# EAGLE design Blocky_Node (EAGLE 9.2.1)

## Sheet 1 of 2
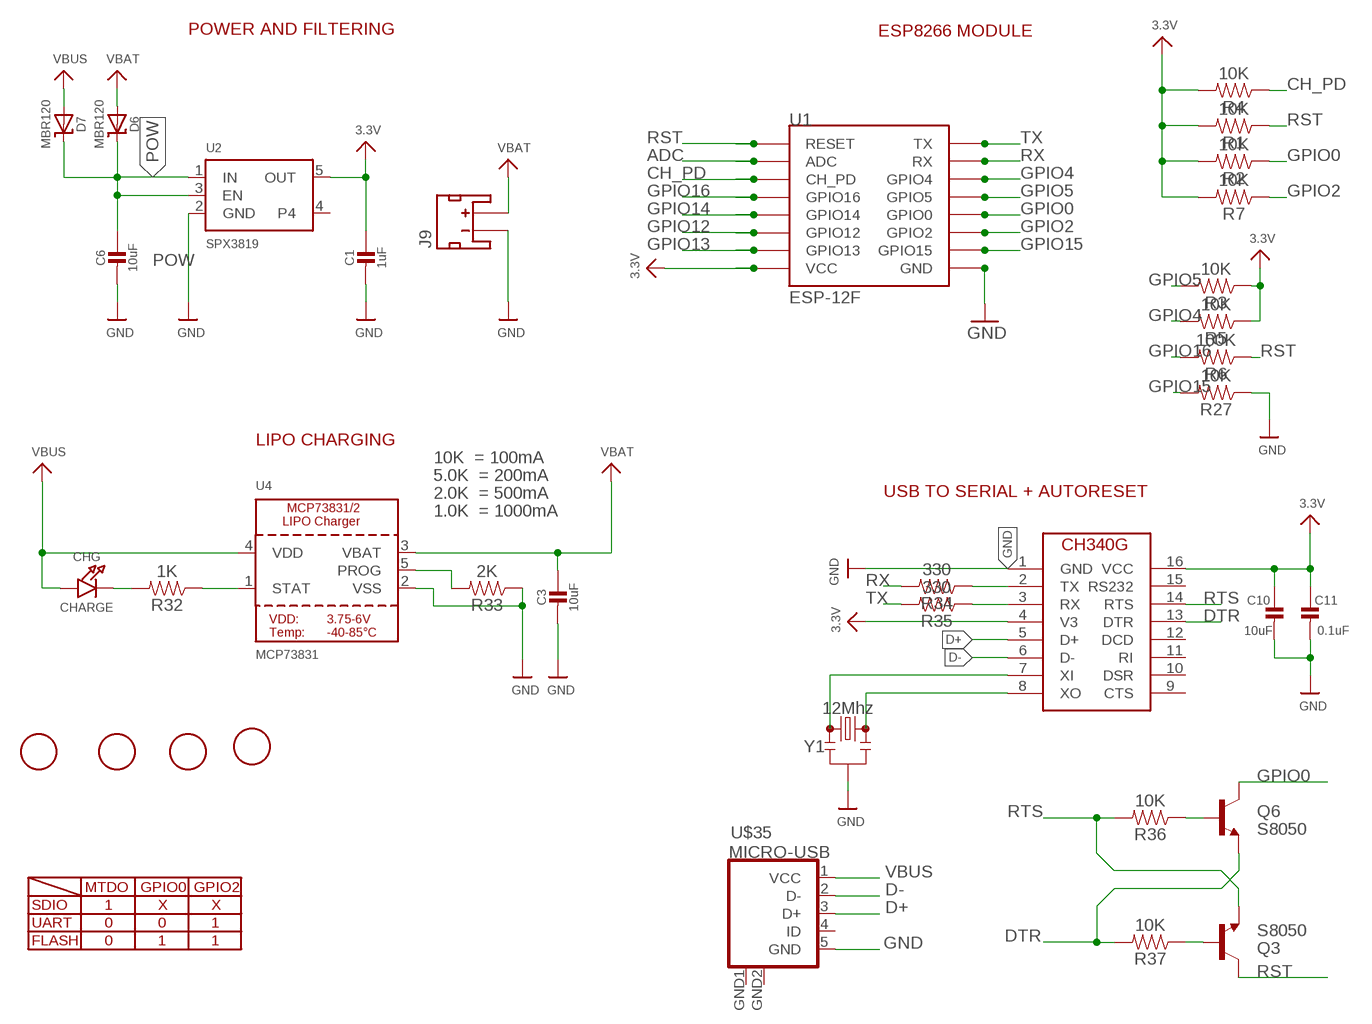
[diagram p0: schematic, sheet 1]

### Parts
C1  1uF  CAP_CERAMIC_0603  [_0603]
C3  10uF  CAP_CERAMIC_0603  [_0603]
C6  10uF  CAP_CERAMIC_0603  [_0603]
C10  10uF  CAP_CERAMIC_0603  [_0603]
C11  0.1uF  CAP_CERAMIC_0603  [_0603]
CHG  CHARGE  LED0603  [CHIPLED_0603]
D6  MBR120  DIODE-SCHOTTKYSOD-123  [SOD-123]
D7  MBR120  DIODE-SCHOTTKYSOD-123  [SOD-123]
J9  JST_2MM_MALE  [JST-2-SMD]
Q3  S8050  TRANSISTOR_NPNSOT23-3  [SOT23-3]
Q6  S8050  TRANSISTOR_NPNSOT23-3  [SOT23-3]
R1  10K  0.27OHM-0603-1/10W-1%  [0603]
R2  10K  0.27OHM-0603-1/10W-1%  [0603]
R3  10K  0.27OHM-0603-1/10W-1%  [0603]
R4  10K  0.27OHM-0603-1/10W-1%  [0603]
R5  10K  0.27OHM-0603-1/10W-1%  [0603]
R6  100K  0.27OHM-0603-1/10W-1%  [0603]
R7  10K  0.27OHM-0603-1/10W-1%  [0603]
R27  10K  0.27OHM-0603-1/10W-1%  [0603]
R32  1K  0.27OHM-0603-1/10W-1%  [0603]
R33  2K  0.27OHM-0603-1/10W-1%  [0603]
R34  330  0.27OHM-0603-1/10W-1%  [0603]
R35  330  0.27OHM-0603-1/10W-1%  [0603]
R36  10K  0.27OHM-0603-1/10W-1%  [0603]
R37  10K  0.27OHM-0603-1/10W-1%  [0603]
U1  ESP-12F  ESP12SMD  [ESP12-SMD]
U2  SPX3819  VREG_SOT23-5  [SOT23-5]
U4  MCP73831  MCP73831/2  [SOT23-5]
U$9  FIDUCIAL  [FIDUCIAL_1MM]
U$10  FIDUCIAL  [FIDUCIAL_1MM]
U$11  FIDUCIAL  [FIDUCIAL_1MM]
U$12  FIDUCIAL  [FIDUCIAL_1MM]
U$35  MICRO-USB  [MICRO-USB]
U$44  CH340G  [SOIC16]
Y1  12Mhz  RESONATOR-16MHZSMD_3.2X1.3  [RESONATOR-SMD-3.2X1.3]

### Nets
3.3V [power]: C1.1 C10.1 C11.1 R1.2 R2.2 R3.1 R4.2 R5.1 R7.2 U1.VCC U2.5(OUT) U$44.4(V3) U$44.16(VCC) ; also sheet 2
ADC: U1.ADC ; also sheet 2
CH_PD: R4.1 U1.CH_PD
D+: U$35.3(D+) U$44.5(D+)
D-: U$35.2(D-) U$44.6(D-)
DTR: Q6.2(E) R37.2 U$44.13(DTR)
GND [power]: C1.2 C3.2 C6.2 C10.2 C11.2 J9.1(-) R27.1 R33.1 U1.GND U2.2(GND) U4.2(VSS) U$35.5(GND) U$44.1(GND) Y1.2 ; also sheet 2
GPIO0: Q6.3(C) R2.1 U1.GPIO0 ; also sheet 2
GPIO2: R7.1 U1.GPIO2 ; also sheet 2
GPIO4: R5.2 U1.GPIO4 ; also sheet 2
GPIO5: R3.2 U1.GPIO5 ; also sheet 2
GPIO12: U1.GPIO12 ; also sheet 2
GPIO13: U1.GPIO13 ; also sheet 2
GPIO14: U1.GPIO14 ; also sheet 2
GPIO15: R27.2 U1.GPIO15 ; also sheet 2
GPIO16: R6.2 U1.GPIO16
N$1: CHG.C R32.2
N$2: Q3.1(B) R37.1
N$5: Q6.1(B) R36.1
N$6: U$44.7(XI) Y1.1
N$10: U$44.8(XO) Y1.3
N$21: R34.1 U$44.2(TX)
N$27: R35.1 U$44.3(RX)
POW [power]: C6.1 D6.C D7.C U2.1(IN) U2.3(EN)
PROG: R33.2 U4.5(PROG)
RST: Q3.3(C) R1.1 R6.1 U1.RESET ; also sheet 2
RTS: Q3.2(E) R36.2 U$44.14(RTS)
RX: R34.2 U1.RXD0(RX) ; also sheet 2
STAT: R32.1 U4.1(STAT)
TX: R35.2 U1.TXD0(TX) ; also sheet 2
VBAT [power]: C3.1 D6.A J9.2(+) U4.3(VBAT)
VBUS [power]: CHG.A D7.A U4.4(VDD) U$35.1(VCC)
Unconnected: J9.NC1(PAD1) J9.NC2(PAD2) U2.4 U$35.4(ID) U$44.9(CTS) U$44.10(DSR) U$44.11(RI) U$44.12(DCD) U$44.15(RS232)

### Notes on the sheet
- POWER AND FILTERING | ESP8266 MODULE
- LIPO CHARGING
- 10K  = 100mA
- 5.0K  = 200mA
- 2.0K  = 500mA | USB TO SERIAL + AUTORESET
- 1.0K  = 1000mA
- MTDO | GPIO0 | GPIO2
- SDIO | 1 | X | X
- UART | 0 | 0 | 1
- FLASH | 0 | 1 | 1

## Sheet 2 of 2
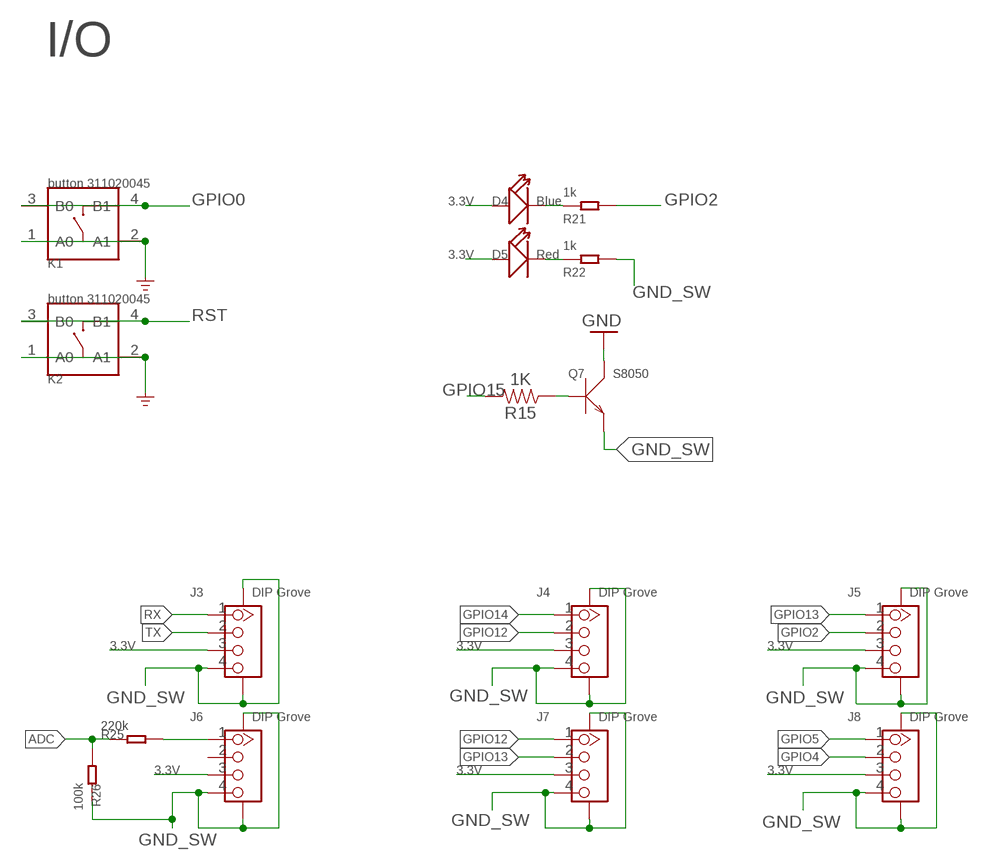
[diagram p1: schematic, sheet 2]

### Parts
D4  Blue  LED'0603'  [LED-0603]
D5  Red  LED'0603'  [LED-0603]
J3  DIP Grove  GROVE-CONNECTOR-SMD'90D'  [HW4-SMD-2.0-90D]
J4  DIP Grove  GROVE-CONNECTOR-SMD'90D'  [HW4-SMD-2.0-90D]
J5  DIP Grove  GROVE-CONNECTOR-SMD'90D'  [HW4-SMD-2.0-90D]
J6  DIP Grove  GROVE-CONNECTOR-SMD'90D'  [HW4-SMD-2.0-90D]
J7  DIP Grove  GROVE-CONNECTOR-SMD'90D'  [HW4-SMD-2.0-90D]
J8  DIP Grove  GROVE-CONNECTOR-SMD'90D'  [HW4-SMD-2.0-90D]
K1  button 311020045  BUTTON-4P-4.5X3.2  [SW4P-SMD-4.5X3.2X2.5MM]
K2  button 311020045  BUTTON-4P-4.5X3.2  [SW4P-SMD-4.5X3.2X2.5MM]
Q7  S8050  SMD-TRANSISTORS-NPN-25V-500MW-S8050(SOT-23)  [SOT-23]
R15  1K  2.0KOHM-0603-1/10W-5%  [0603]
R21  1k  RES-0603  [R0603]
R22  1k  RES-0603  [R0603]
R25  220k  RES-0603  [R0603]
R26  100k  RES-0603  [R0603]

### Nets
3.3V [power]: D4.+ D5.+ J3.3 J4.3 J5.3 J6.3 J7.3 J8.3 ; also sheet 1
ADC: R25.1 R26.2 ; also sheet 1
GND [power]: K1.1(A0) K1.2(A1) K2.1(A0) K2.2(A1) Q7.3(C) ; supply symbol labelled GND_POWER ; also sheet 1
GND_SW [power]: J3.4 J3.SS1 J3.SS2 J4.4 J4.SS1 J4.SS2 J5.4 J5.SS1 J5.SS2 J6.4 J6.SS1 J6.SS2 J7.4 J7.SS1 J7.SS2 J8.4 J8.SS1 J8.SS2 Q7.2(E) R22.2 R26.1
GPIO0: K1.3(B0) K1.4(B1) ; also sheet 1
GPIO2: J5.2 R21.2 ; also sheet 1
GPIO4: J8.2 ; also sheet 1
GPIO5: J8.1 ; also sheet 1
GPIO12: J4.2 J7.1 ; also sheet 1
GPIO13: J5.1 J7.2 ; also sheet 1
GPIO14: J4.1 ; also sheet 1
GPIO15: R15.2 ; also sheet 1
N$9: J6.1 R25.2
N$14: D4.- R21.1
N$22: D5.- R22.1
N$30: Q7.1(B) R15.1
RST: K2.3(B0) K2.4(B1) ; also sheet 1
RX: J3.1 ; also sheet 1
TX: J3.2 ; also sheet 1
Unconnected: J6.2

### Notes on the sheet
- I/O

## Power pins joined to a net without a drawn wire
GND: U$35.GND1(GND) U$35.GND2(GND)

## Library data of the parts
C1 C3 C6 C10 C11 = microbuilder:CAP_CERAMIC: Ceramic Capacitors For new designs, use the packages preceded by an '_' character since they are more reliable: The following footprints should be used on most boards: _0402 - Standard footprint for regular board layouts _0603 - Standard footprint for regular board layouts _0805 - Standard footprint for regular board layouts _1206 - Standard footprint for regular board layouts For extremely tight-pitch boards where space is at a premium, the following 'micro-pitch' footprints can be used (smaller pads, no silkscreen outline, etc.): _0402MP - Micro-pitch footprint for very dense/compact boards _0603MP - Micro-pitch footprint for very dense/compact boards _0805MP - Micro-pitch footprint for very dense/compact boards _1206MP - Micro-pitch footprint for very dense/compact boards
CHG = microbuilder:LED: LED 0603 - 0603 Surface Mount Package 2mA: Green LED - Low Power (3.9mcd, 2ma, 1.7Vf) - Digikey: 475-2709-2-ND Orange LED - Low Power (9.8mcd, 2ma, 1.8Vf) - Digikey: 475-1194-2-ND Red LED - Low Power (5mcd, 2ma, 1.8Vf) - Digikey: 475-1195-2-ND Yellow LED - Low Power (7mcd, 2ma, 1.8Vf) - Digikey: 475-1196-2-ND 5mA: Blue LED - Low Power (17mcd, 5ma, 2.9Vf) - Digikey: LNJ937W8CRACT-ND 0805 - 0805 Surface Mount Package 2mA: Red LED (8.8mcd, 2mA, 1.8Vf, Clear) - Low Power [Digikey: 475-2510-1-ND] Green LED (5mcd, 2mA, 1.8Vf, Clear) - Low Power [Digikey: 475-2730-1-ND] Yellow LED (11.3mcd, 2mA, 1.8Vf, Clear) - Low Power [Digikey: 475-2555-1-ND] 20mA: Red LED (104mcd, 20mA, Diffused) - LS R976 [Digikey: 475-1278-6-ND] Red LED (12mcd, 20mA, 2.0Vf, Clear) - APT2012EC [Digikey: 754-1128-1-ND] Green LED (15mcd, 20mA, 2.2Vf, Clear) - APT2012GC [Digikey: 754-1131-1-ND] Orange LED (160mcd, 20mA, 2.1Vf, Clear) - APT2012SECK [Digikey: 754-1130-1-ND] 1206 - 1206 Surface Mount Package Green LED (26mcd, 20mA, Diffused) - LG N971 [Digikey: 475-1407-6-ND] Red LED (15mcd, 20mA, Diffused) - LH N974 [Digikey: 475-1416-6-ND] Cree - Cree High-Power Surface Mount LEDs XPEBWT-L1-0000-00D50 - White 111lm 350mA 2.9Vf 6200K 110° XTEAWT-00-0000-00000LEE3 - White 114lm 350mA 2.85Vf 5000K 115° Everlight - Everlight 45-21 Series Surface Mount LEDs 45-21/QK2C-B2832AC2CB2/2T - Warm White 2000mcd 20mA 3.25Vf 3050K 120° 45-21/LK2C-B38452C4CB2/2T - Nuetral White 2000mcd 20mA 3.25Vf 4150K 120° 45-21/LK2C-B50634C6CB2/2T - Cold White 2200mcd 20mA 3.25Vf 5650K 120° PLCC2 Reverse Mount LS T77K-J1L2-1-0-2-R18-Z - Red 11.25mcd 2mA 1.8Vf 630nm 120° LO T77K-L1M2-24-Z - Orange 19.6mcd 2mA 1.8Vf 606nm 120° LY T77K-K2M1-26-Z - Yellow 15.7mcd 2mA 1.8Vf 587nm 120°
D4 D5 = Discrete-new:LED
D6 D7 = microbuilder:DIODE-SCHOTTKY
J3-J8 = Connector-new:GROVE-CONNECTOR-SMD: 4P-SMD-2.0:320110030;4P-SMD-2.0-90D:320110032
J9 = SparkFun-Connectors:JST_2MM_MALE: JST 2MM MALE RA CONNECTOR Two pin, compact surface mount connector. Commonly used as a battery input connection point. We really like the solid locking feeling and high current rating on these small connectors. We use these all the time as battery connectors. Mates to single-cell LiPo batteries. Here is the connector we sell at SparkFun: JST Right Angle Connector - White <https://www.sparkfun.com/products/8612> (PRT-08612) Datasheet <http://www.sparkfun.com/datasheets/Prototyping/Connectors/JST-Horizontal.pdf> It was used on these SparkFun products: SparkFun MOSFET Power Controller <https://www.sparkfun.com/products/11214> (PRT-11214) SparkFun Battery Babysitter - LiPo Battery Manager <https://www.sparkfun.com/products/13777> (PRT-13777) And many, many others that required a lipo battery connection.; PROD_ID: CONN-11443; SF_ID: PRT-08612
K1 K2 = Discrete-new:BUTTON-4P: SW4-6.0X6.0X5.0MM:311020024;SW4-8.0X8.0X9.0MM:311020028;SW4-SMD-6.0X6.0X5.0MM:311020004;SW4-SMD-3.35X3.35X1.5MM:311020030;SW4-SMD-5.2X5.2X2.5MM:311020046
Q3 Q6 = SparkFun:TRANSISTOR_NPN: Transistor NPN BJT configuration in SOT23 package. MMBT2222 is the common NPN we use. Double check BCE configuration again layout.
Q7 = Seeed-Transistor:SMD-TRANSISTORS-NPN-25V-500MW-S8050(SOT-23): 305010017; MPN: S8050
R1-R7 R27 R32-R37 = SparkFun-Resistors:0.27OHM: 0.27Ω resistor A resistor is a passive two-terminal electrical component that implements electrical resistance as a circuit element. Resistors act to reduce current flow, and, at the same time, act to lower voltage levels within circuits. - Wikipedia; PROD_ID: RES-08787; VALUE: 0.27
R15 = SparkFun-Resistors:2.0KOHM: 2kΩ resistor A resistor is a passive two-terminal electrical component that implements electrical resistance as a circuit element. Resistors act to reduce current flow, and, at the same time, act to lower voltage levels within circuits. - Wikipedia; PROD_ID: RES-08296; VALUE: 2.0k
R21 R22 R25 R26 = Discrete-new:RES
U1 = esp8266modules:ESP12: ESP8266 Wifi module 12
U2 = microbuilder:VREG_SOT23-5: SOT23-5 Fixed Voltage Regulators Part Current Out V Out V In V Dropout θJA (°C/W) TJ (°C) Digikey Part No. ADP121 150mA 3.3V 3.4-5.5V 0.09V @ 150mA -- -- ADP121-AUJZ33R7CT-ND ADP121 150mA 3.0V 3.1-5.5V 0.09V @ 150mA -- -- ADP121-AUJZ30R7CT-ND ADP122 300mA 3.3V 3.4-5.5V 0.085V @ 300mA -- -- ADP122AUJZ-3.3-R7CT-ND ADP1712 300mA 3.3V 3.5-5.5V 0.17V @ 300mA -- -- ADP1712AUJZ-3.3-R7TR-ND AP7311 (Low Cost) 150mA 3.3V 3.5-6V 0.15V @ 150mA -- -- AP7311-33WG-7DICT-ND LD39015M18R 150mA 1.8V 1.9V-5.5V 0.08V @ 100mA -- -- 497-6977-1-ND LP2985A-33DBVR 150mA 3.3V 3.3-16V 0.28V @ 150mA 206 150 296-18479-1-ND MCP1824T-3302E/OT 300mA 3.3V 3.5V-6V 0.2V @ 300mA -- -- MCP1824T-3302E/OTCT-ND MIC5205-2.5YM5 TR 150mA 2.5V 2.7-16V 0.165V @ 150mA -- -- 576-1257-2-ND MIC5205-3.0YM5 TR 150mA 3.0V 3.2V-16V 0.165V @ 150mA -- -- 576-1258-2-ND MIC5205-3.3YM5 TR 150mA 3.3V 3.5V-16V 0.165V @ 150mA -- -- 576-1259-2-ND TPS780330220 150mA 3.3V+2.2V 3.6-5.5V 250mV Max -- -- 296-23332-1-ND TDA3663/N1,135 100mA 3.3V 3.5-45V 0.18V @ 50mA -- -- 568-5343-1-ND Max operating temp can be calculated using θJA, TJ (max junction temperature), and power in watts. Set the "Maximum Ambient Temperature" until it reaches TJ ("Max Junction Temperature"), which is the absolute limit for safe use of the regulator: Heat Sink Temperature Calculator <http://www.daycounter.com/Calculators/Heat-Sink-Temperature-Calculator.phtml> For example, With 12V source into a 3.3V LP2985 and a 30mA load, we are dissipating (12V-3.3V) * 0.03A = 0.261W. With a θJA of 206 °C/W, a TJ of 150°C, and 261mW we can safely use the chip without a heat sink up to 75°C (=147.1°C Junction Temperature).
U4 = microbuilder:MCP73831/2: MCP73831/2 LIPO Charger VDD: 3.75 - 6V Temp -40 - 85°C Programmable Charge Rate: 15-500mA NOTE: STAT is a tri-state logic output on the MCP73831 and an open-drain output on the MCP73832. SOT23-5 with 4.2V output and tri-state logic on STAT = MCP73831T-2ACI/OT
U$9-U$12 = adafruit:FIDUCIAL: For use by pick and place machines to calibrate the vision/machine, 1mm By microbuilder.eu
U$35 = My-Eagle-Lib:MICRO-USB: Micro USB B connector
U$44 = My-Eagle-Lib:CH340G
Y1 = SparkFun-Clocks:RESONATOR-16MHZ: 16MHz Resonator Digikey Example <http://www.digikey.com/product-detail/en/murata-electronics-north-america/CSTCE16M0V53-R0/490-1198-1-ND/584635> Frequency: 16MHz Frequency Stability: ±0.3% Frequency Tolerance: ±0.5% Capacitance: 15pF SparkFun Products SparkFun OpenLog <https://www.sparkfun.com/products/13712> SparkFun MicroView - OLED Arduino Module <https://www.sparkfun.com/products/12923>; PROD_ID: XTAL-08900; VALUE: 16MHz

## Net classes
1 power: width 0.381 mm

## Board
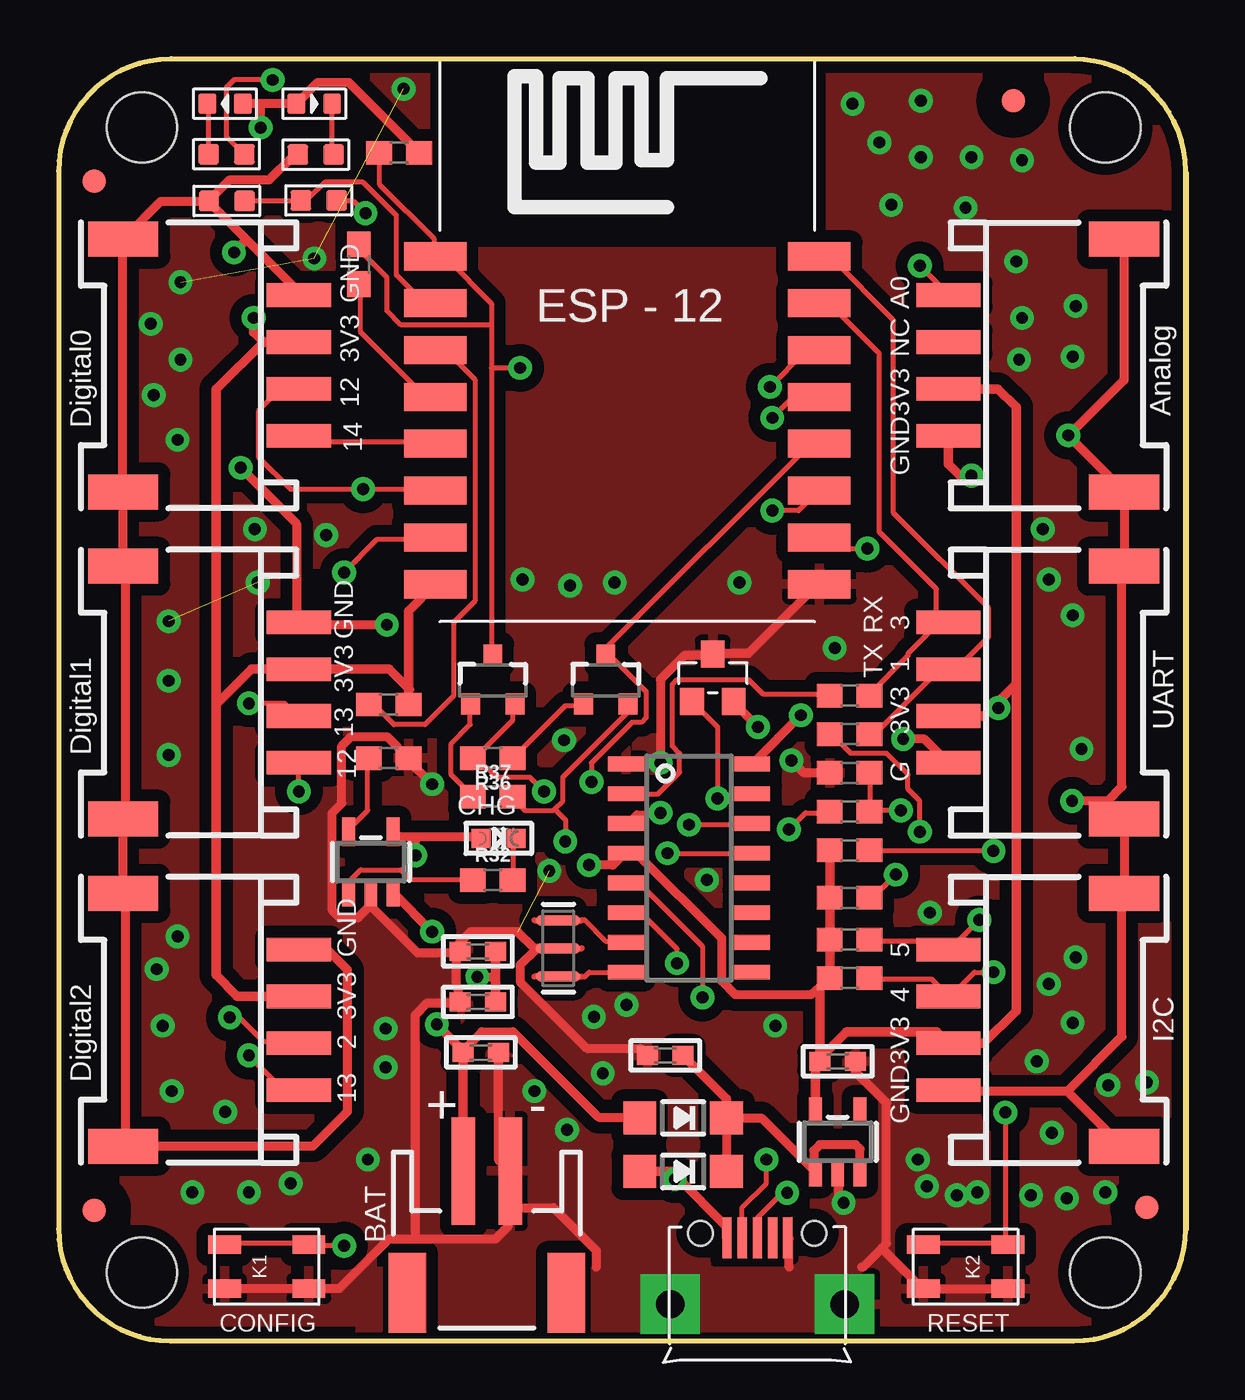
[diagram p2: board, top side]
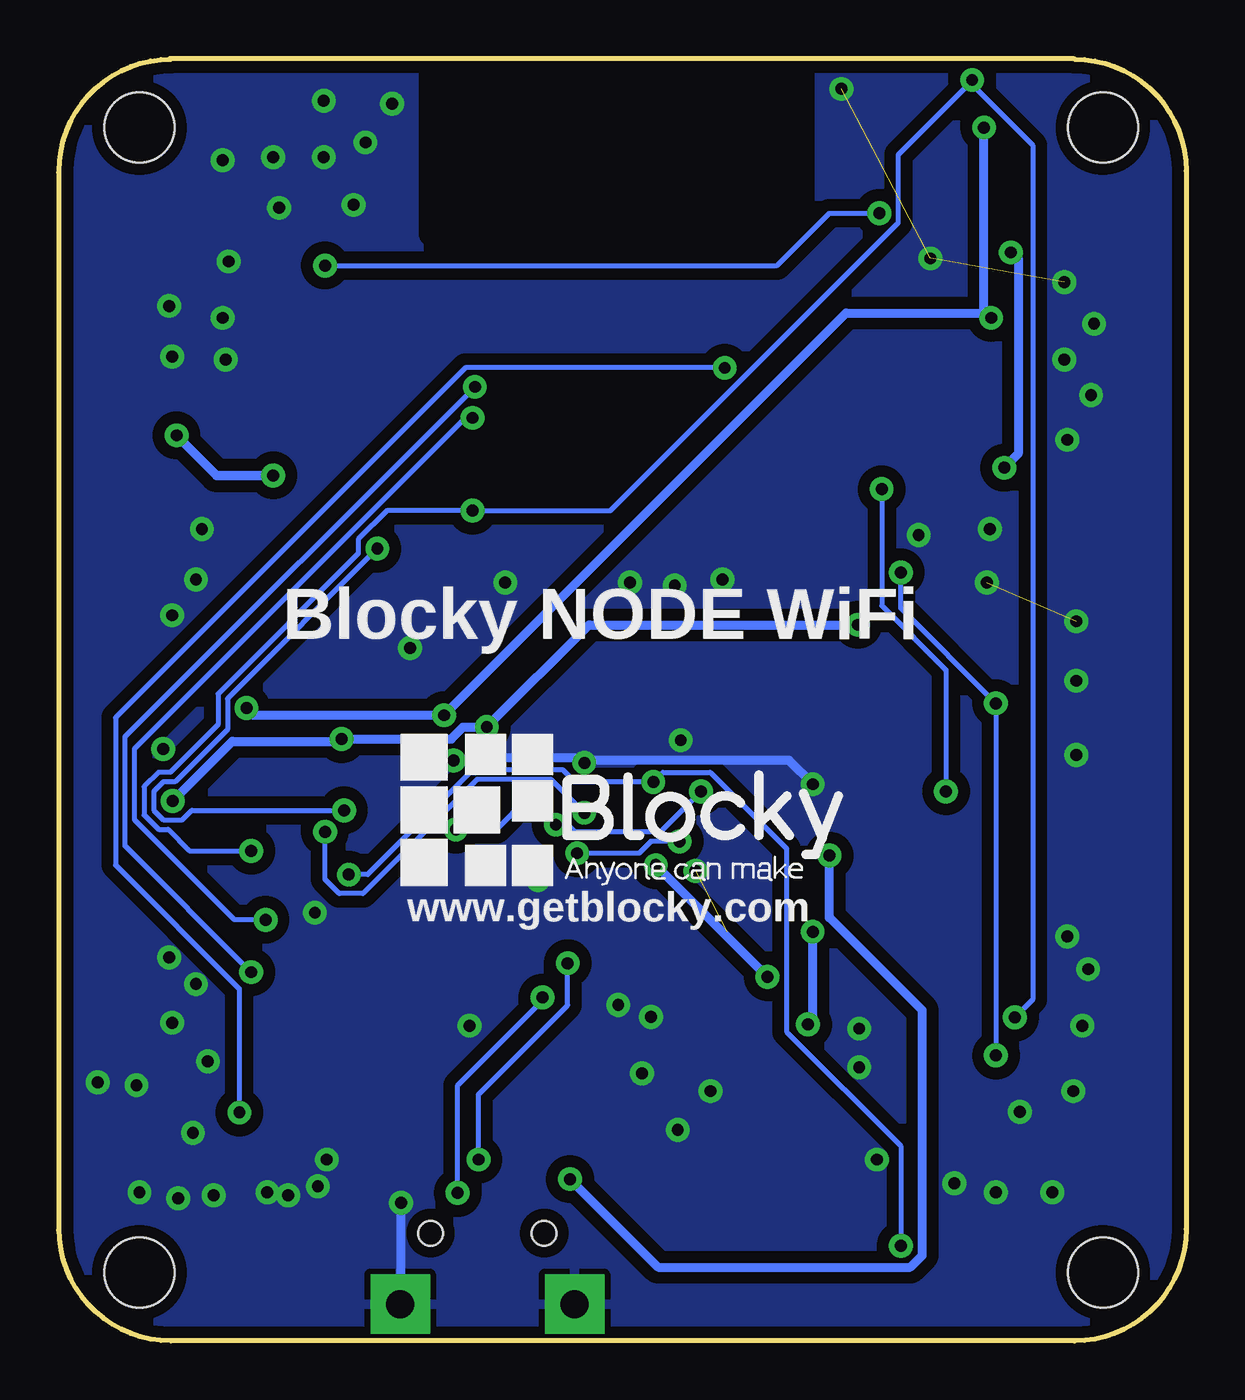
[diagram p3: board, bottom side, seen from below]

Size 48.16 x 54.76 mm. Coordinates in mm from the lower left corner, seen from the top.
Outline: 43.35,54.74 arc-90 48.13,49.96 48.13,4.78 arc-90 43.35,0 4.78,0 arc-90 0,4.78 0,49.96 arc-90 4.78,54.74
Outline: 48.16,49.91 48.16,4.73
Outline: 4.83,54.76 43.4,54.76
Copper layers (1*16): Top 0.035mm / dielectric 1.5mm / Bottom 0.035mm
Design rules "SparkFun": minimum track width 8mil, minimum drill 20mil, track to track 8mil, track to pad 8mil, pad to pad 8mil, via to via 8mil, smd to smd 8mil, copper to edge 10mil, drill to drill 8mil, minimum pad ring 12mil, minimum via ring 10mil, stop-mask expansion 4mil, vias tented up to drill 25mil, thermal gap 10mil
Holes 3 mm at 3.56,2.92 44.7,2.92 3.56,51.82 44.7,51.82
tRestrict: area 16.4,47.2 to 32.3,54.5
bRestrict: area 16.4,47.2 to 32.3,54.5

### Footprints (pad centres in the part's own frame; a part is rotated, then mirrored left to right if it is on the bottom)
_0603 = smd 0.9 x 0.8: 1 -0.762,0; 2 0.762,0
CHIPLED_0603 = smd 0.8 x 0.8: A 0,-0.75; C 0,0.75
LED-0603 = smd 0.762 x 0.889: + -0.762,0; - 0.762,0
SOD-123 = smd 1.4 x 1.4: A 1.85,0; C -1.85,0
HW4-SMD-2.0-90D = smd 1.01 x 2.74: 1 -3,-0.1; 2 -1,-0.1; 3 1,-0.1; 4 3,-0.1 | smd 1.5 x 3: SS1 -5.4,7.4; SS2 5.4,7.4
JST-2-SMD = smd 1 x 4.6: 1 -1,-3.7; 2 1,-3.7 | smd 1.6 x 3.4: NC1 -3.4,1.5; NC2 3.4,1.5
SW4P-SMD-4.5X3.2X2.5MM = smd 1.4 x 0.8: 1 -1.8,-0.94; 2 1.8,-0.94; 3 1.8,0.94; 4 -1.8,0.94
SOT23-3 = smd 0.8 x 0.9: 1 -0.95,-1; 2 0.95,-1; 3 0,1.1
SOT-23 = smd 1.016 x 1.143: 1 -0.889,-1.016; 2 0.889,-1.016; 3 0,1.016
0603 = smd 1.1 x 1: 1 -0.85,0; 2 0.85,0
R0603 = smd 0.889 x 0.889: 1 0,0.762; 2 0,-0.762
ESP12-SMD = smd 2.667 x 1.2: ADC -8.3,3.8; CH_PD -8.3,1.8; GND 8.1,-8.2; GPIO0 8.1,-2.2; GPIO2 8.1,-4.2; GPIO4 8.1,1.8; GPIO5 8.1,-0.2; GPIO12 -8.3,-4.2; GPIO13 -8.3,-6.2; GPIO14 -8.3,-2.2; GPIO15 8.1,-6.2; GPIO16 -8.3,-0.2; RESET -8.3,5.8; RXD0 8.1,3.8; TXD0 8.1,5.8; VCC -8.3,-8.2
SOT23-5 = smd 0.55 x 1.2: 1 -0.95,-1.3; 2 0,-1.3; 3 0.95,-1.3; 4 0.95,1.3; 5 -0.95,1.3
FIDUCIAL_1MM = smd 1 x 1: 1 0,0
MICRO-USB = smd 0.4 x 1.75: 1 -1.3,4.525; 2 -0.65,4.525; 3 0,4.525; 4 0.65,4.525; 5 1.3,4.525 | drill 1.2 pad 2.54 square: GND1 -3.725,1.7; GND2 3.725,1.7 | hole 1.05: -2.425,4.73; 2.425,4.73
SOIC16 = smd 0.635 x 1.524: 1 -4.445,-2.695; 2 -3.175,-2.695; 3 -1.905,-2.695; 4 -0.635,-2.695; 5 0.635,-2.695; 6 1.905,-2.695; 7 3.175,-2.695; 8 4.445,-2.695; 9 4.445,2.695; 10 3.175,2.695; 11 1.905,2.695; 12 0.635,2.695; 13 -0.635,2.695; 14 -1.905,2.695; 15 -3.175,2.695; 16 -4.445,2.695
RESONATOR-SMD-3.2X1.3 = smd 0.45 x 1.905: 1 -1.2,0; 2 0,0; 3 1.2,0

### Placement (x,y rotation side)
C1  33.27,11.94 0 top
C3  18.03,12.32 0 top
C6  25.91,12.19 180 top
C10  17.91,16.64 180 top
C11  17.91,14.48 180 top
CHG  18.8,21.46 270 top
D4  7.11,52.83 180 top
D5  10.92,52.83 0 top
D6  26.67,9.53 180 top
D7  26.67,7.24 180 top
J3  38.1,27.69 270 top
J4  10.16,41.66 90 top
J5  10.16,13.72 90 top
J6  38.1,41.66 270 top
J7  10.16,27.69 90 top
J8  38.1,13.72 270 top
J9  18.29,3.56 180 top
K1  8.89,3.17 0 top
K2  38.73,3.17 0 top
Q3  18.54,28.19 0 top
Q6  23.37,28.19 0 top
Q7  27.94,28.32 0 top
R1  14.54,50.74 0 top
R2  33.78,18.92 180 top
R3  33.78,17.15 0 top
R4  14.1,27.18 0 top
R5  33.78,15.49 0 top
R6  12.83,45.97 270 top
R7  33.78,20.95 180 top
R15  33.78,22.61 0 top
R21  7.18,50.67 90 top
R22  10.99,50.66 270 top
R25  11.11,48.7 90 top
R26  7.19,48.68 90 top
R27  33.78,24.26 0 top
R32  18.54,19.69 0 top
R33  14.1,24.89 180 top
R34  33.78,27.56 0 top
R35  33.78,25.91 0 top
R36  18.54,24.89 180 top
R37  18.54,23.24 0 top
U1  24.38,40.51 0 top
U2  33.27,8.51 0 top
U4  13.34,20.45 0 top
U$9  1.52,49.53 0 top
U$10  40.77,52.96 0 top
U$11  1.52,5.59 0 top
U$12  46.48,5.71 0 top
U$15  [BLOCKY_LOGO]  34.54,19.18 0 bottom
U$35  29.84,-0.13 0 top
U$44  26.92,20.19 270 top
Y1  21.34,16.76 270 top

### Tracks (layer width: path | path; a pad name or v marks a point on that pad's centre or on a via)
3.3V  (via drill 0.51)
  Top 0.381: 8.64,52.83 D5.+ 11.07,53.75 12.39,53.75 15.34,50.8 R1.2 | 8.64,52.83 D4.+ | v8.64,51.82 8.64,52.83 | v8.33,43.69 8.33,43.08 8.75,42.66 | R5.1 32.12,14.78 28.91,14.78 28.32,15.37 28.32,17.2 24.69,20.83 U$44.4 24.08,20.73 23.67,20.32 v22.66,20.32 | v31.7,26.72 29.67,24.69 U$44.16 | v40.13,27.03 39.99,27.16 | v17.88,15.54 18.67,15.54
  Top 0.406: U2.5 32.32,11.75 C1.1 | C1.1 32.51,12.06 33.66,13.21 37.51,13.21 J8.3 38.02,12.7 39.5,12.7 40.89,14.1 40.89,28.07 | C1.1 32.51,15.07 R5.1 R3.1 R2.2 R7.2 | C10.1 18.67,15.54 C11.1 | J5.3 7.64,14.72 6.73,15.62 6.73,27.18 | 6.73,27.18 8.24,28.69 J7.3 14.11,28.69 14.99,27.81 14.95,27.77 R4.2 14.95,31.18 U1.VCC | 6.73,27.18 6.73,40.64 8.75,42.66 8.76,42.67 8.78,42.66 J4.3 | J6.3 40.12,40.66 40.89,39.88 40.89,28.07 | 40.89,28.07 39.99,27.16 39.5,26.67 39.48,26.69 J3.3
  Bottom 0.381: v8.64,51.82 8.64,43.99 v8.33,43.69 8.74,43.89 14.53,43.89 v31.7,26.72 39.83,26.72 v40.13,27.03 | v22.66,20.32 v17.88,15.54
ADC
  Top 0.203: R26.2 8.03,48.67 10.26,48.67 R25.1 10.36,48.77 10.67,48.77 11.38,49.48 13.01,49.48 14.43,48.06 14.43,45.52 15.54,44.4 16.05,44.4 U1.ADC
CH_PD
  Top 0.203: R4.1 13.31,27.13 13.51,27.13 14.33,26.31 15.65,26.31 16.87,27.53 16.87,30.68 17.78,31.6 17.78,41.05 16.56,42.27 16.15,42.27 U1.CH_PD
D+  (via drill 0.51)
  Top 0.203: v27.49,14.67 27.49,16.86 24.84,19.51 24.28,19.51 U$44.5 | U$35.3 29.86,4.42 29.86,5.27 30.92,6.33 v31.11,6.33
  Bottom 0.203: v31.11,6.33 31.11,10.92 27.49,14.54 v27.49,14.67
D-  (via drill 0.51)
  Top 0.203: U$44.6 24.87,18.29 26.42,16.74 v26.42,16.13 | U$35.2 29.2,5.7 30.23,6.73 v30.23,7.75
  Bottom 0.203: v30.23,7.75 30.23,10.53 26.42,14.34 v26.42,16.13
DTR  (via drill 0.51)
  Top 0.203: 21.18,22.71 21.13,22.66 19.91,22.66 19.41,23.16 R37.2 | 21.18,22.71 21.54,23.06 21.54,24.08 24.28,26.82 24.28,27.13 Q6.2 | v26.01,20.83 29.57,20.83 U$44.13 | v21.64,21.34 21.64,22.25 21.23,22.66 21.18,22.71
  Bottom 0.203: v26.01,20.83 23.37,20.83 22.86,21.34 v21.64,21.34
GND  (via drill 0.51)  (4 unrouted)
  Top 0.381: v31.29,24.79 31.8,24.28 32.92,24.28 R27.1 | U$44.1 24.28,24.69 v25.7,24.69 25.7,28.24 26.72,29.26 27.84,29.26 Q7.3 27.94,29.36 29.46,29.36 32.41,32.31 U1.GND | 13.31,18.59 12.8,18.09 11.99,18.09 11.68,18.39 11.68,22.55 12.09,22.96 12.09,25.4 12.5,25.81 14.02,25.81 14.94,24.89 R33.1 14.94,24.79 v15.95,23.77 | 13.31,18.59 13.31,19.1 U4.2 | C10.2 16.97,16.46 16.97,15.14 17.07,15.04 17.07,14.53 C11.2 16.97,14.43 15.75,14.43 15.24,13.92 15.24,4.34 | C6.2 24.84,12.5 22.55,12.5 19.71,15.34 19.71,16.05 20.32,16.66 20.32,16.76 | C10.2 17.14,17.02 17.6,17.48 19.61,17.48 20.32,16.76 | 13.31,18.59 15.34,16.56 16.87,16.56 C10.2 | C1.2 34.04,11.48 35.36,10.16 35.36,4.17 35.15,3.96 | 35.15,3.96 34.34,3.15 34.29,3.15 | v33.53,5.89 33.33,6.1 33.33,7.11 U2.2 | 35.15,3.96 36.88,2.24 K2.1 37.08,2.24 40.44,2.24 K2.2 | 31.19,3.15 31.19,4.37 U$35.5 | K1.1 7.11,2.24 10.67,2.24 K1.2 10.87,2.24 11.99,2.24 14.1,4.34 15.24,4.34 | C3.2 18.8,7.72 19.2,7.32 J9.1 | 15.24,4.34 18.64,4.34 19.2,4.9 19.2,7.11 J9.1 | 22.96,3.15 22.96,3.86 21.13,5.69 19.3,5.69 J9.1 | Y1.2 20.32,16.76
  Bottom 0.381: v31.29,24.79 30.79,24.79 30.68,24.89 25.91,24.89 v25.7,24.69 25.6,24.79 16.97,24.79 v15.95,23.77 | v33.53,5.89 33.53,1.63 U$35.GND2
  other vias: 4.7,30.73 4.7,28.19 4.7,25.02 5.08,17.27 4.19,15.88 4.45,13.46 4.83,10.67 7.11,9.78 5.71,6.35 8.13,6.35 9.91,6.73 13.21,7.75 27.69,19.69 36.7,7.75 37.08,6.6 38.35,6.22 39.24,6.35 41.53,6.22 43.05,6.1 42.42,8.89 46.48,11.05 44.83,10.92 41.78,11.94 43.31,13.59 42.29,15.24 43.43,16.38 29.08,32.38 30.61,13.46 33.15,29.59 37.21,18.29 43.69,25.27 43.31,30.99 42.29,32.51 42.04,34.67 43.31,42.04 41.02,41.91 41.15,43.69 43.43,44.2 40.89,46.1 38.73,48.39 35.56,48.51 41.15,50.42 38.99,50.55 36.83,50.55 35.05,51.18 33.91,52.83 36.83,52.96 8.51,32.38 8.38,34.67 11.43,34.42 19.81,32.51 21.84,32.26 23.75,32.38 5.08,38.48 4.06,40.39 5.21,41.91 3.94,43.43 5.21,45.21 10.92,46.23 14.73,53.47 13.97,11.68 13.97,13.34 44.7,6.35 21.72,9.02 20.32,10.67 23.24,11.43 22.86,13.84 24.26,14.35 20.95,20.07 21.59,25.65
  pour Top (isolate 0.254, no thermals): 12.7,3.17 34.29,3.17 34.29,0.38 12.7,0.38
  pour Top (isolate 0.508): 0.13,54.74 48.26,54.74 48.26,0 0.13,0
  pour Bottom (isolate 0.508): 0,54.74 48.26,54.74 48.26,0 0,0
GND_SW  (via drill 0.51)
  Top 0.381: R26.1 6.4,48.67 4.37,48.67 2.85,47.14 J4.SS2 2.74,46.94 2.74,36.37 J4.SS1 2.74,36.17 2.74,33.12 J7.SS2 2.85,32.92 2.85,22.45 J7.SS1 2.74,22.25 2.74,19.2 J5.SS2 2.85,19 2.85,8.43 J5.SS1 2.85,8.33 10.87,8.33 12.34,9.8 12.34,15.85 11.53,16.66 10.26,16.66 J5.4 | R22.2 10.16,50.6 10.01,50.6 8.99,49.58 7.32,49.58 6.5,48.77 R26.1 | v7.77,37.29 10.16,34.9 10.16,30.78 J7.4 10.36,30.58 v14.02,30.58 | 10.26,44.6 J4.4 10.26,44.81 7.98,47.09 | 7.98,47.09 6.5,48.56 R26.1 | 38,38.71 J6.4 | v29.87,26.21 28.85,27.23 Q7.2 | v36.07,25.7 36.98,25.7 J3.4 | 43.08,10.67 38.1,10.67 J8.4 | 43.08,10.67 45.41,8.33 J8.SS2 | 43.08,10.67 45.41,13.01 45.41,19 J8.SS1 45.52,19.2 45.52,22.25 J3.SS2 45.41,22.45 44.81,23.06 | 44.81,23.06 v43.28,23.06 | 44.81,23.06 45.41,23.67 45.41,32.92 J3.SS1 45.52,33.12 45.52,36.17 J6.SS2 45.41,36.37 v43.12,38.67 43.08,38.63 43.08,38.61 45.5,41.03 J6.SS1 | v7.49,46.48 7.98,46.96 7.98,47.09
  Top 0.406: J6.4 38,37.44 38.61,36.83 38.86,36.83 v38.99,36.96
  Bottom 0.381: v43.28,23.06 40.74,25.6 36.17,25.6 v36.07,25.7 31.39,25.7 30.89,26.21 v29.87,26.21 25.5,30.58 v14.02,30.58 | v7.77,37.29 7.18,37.88 7.18,46.23 7.43,46.48 v7.49,46.48
  Bottom 0.406: v38.99,36.96 41.4,36.96 v43.12,38.67
GPIO0  (via drill 0.51)
  Top 0.203: K1.4 7.11,4.17 10.67,4.17 K1.3 10.77,4.06 v12.19,4.06 | 23.37,29.46 23.37,29.57 32.11,38.3 32.41,38.3 U1.GPIO0 | 23.37,29.46 23.37,29.36 Q6.3 23.37,29.46 | v35.76,19.91 34.85,19 34.65,19 R2.1 | v22.76,23.88 22.76,24.69 24.49,26.42 24.89,26.42 25.09,26.62 25.09,27.74 23.37,29.46
  Bottom 0.203: v35.76,19.91 34.95,19.91 30.48,24.38 26.62,24.38 26.11,23.88 v22.76,23.88 22.35,24.28 20.32,24.28 17.07,21.03 17.07,13.21 12.19,8.33 v12.19,4.06
GPIO2  (via drill 0.51)
  Top 0.203: v30.48,35.46 31.6,35.46 32.41,36.27 U1.GPIO2 | v39.93,20.93 34.65,20.93 R7.1 | v7.32,13.82 7.72,13.82 8.74,12.8 10.16,12.8 J5.2 | v9.14,53.85 7.49,53.85 7.16,53.52 7.16,51.46 7.18,51.43 R21.2
  Bottom 0.203: v9.14,53.85 9.14,53.8 9.22,53.72 | 9.22,53.72 12.29,50.65 12.29,47.75 24.59,35.46 v30.48,35.46 34.14,35.46 35.36,34.24 35.36,33.63 41.35,27.63 41.35,26.31 43.38,24.28 43.89,24.28 44.5,23.67 44.5,22.45 43.89,21.84 43.48,21.84 42.57,20.93 v39.93,20.93 | v7.32,13.82 6.55,14.58 6.55,51.05 9.22,53.72
GPIO4  (via drill 0.51)
  Top 0.203: R5.2 34.65,15.44 37.29,15.44 38,14.73 J8.2 38.1,14.73 39.12,15.75 v39.93,15.75 | v30.38,40.74 31.9,42.27 32.41,42.27 U1.GPIO4
  Bottom 0.203: v30.38,40.74 45.31,25.81 45.31,21.13 v39.93,15.75
GPIO5  (via drill 0.51)
  Top 0.203: R3.2 34.65,17.07 37.69,17.07 38,16.76 J8.1 38.1,16.76 v39.32,17.98 | v30.48,39.42 31.29,40.23 32.41,40.23 U1.GPIO5
  Bottom 0.203: v30.48,39.42 30.79,39.42 44.91,25.3 44.91,22.25 40.64,17.98 v39.32,17.98
GPIO12  (via drill 0.51)
  Top 0.203: U1.GPIO12 16.05,36.37 v13.01,36.37 9.91,36.37 8.53,37.74 8.53,39.7 9.47,40.64 10.16,40.64 J4.2 | v10.26,23.47 10.26,24.59 J7.1
  Bottom 0.203: v10.26,23.47 10.26,28.65 13.01,31.39 v13.01,36.37
GPIO13  (via drill 0.51)
  Top 0.203: v12.19,32.82 13.61,34.24 16.05,34.24 U1.GPIO13 | v8.13,27.23 9.65,27.23 10.16,26.72 J7.2 | v8.13,12.19 9.55,10.77 10.16,10.77 J5.1
  Bottom 0.203: v12.19,32.82 12.19,31.29 v8.13,27.23 v8.13,12.19
GPIO14
  Top 0.203: U1.GPIO14 16.05,38.41 10.46,38.41 10.26,38.61 J4.1
GPIO15  (via drill 0.51)
  Top 0.203: R27.2 34.65,24.18 34.65,22.66 R15.2 34.75,22.66 v35.97,22.66 | v34.54,33.83 32.92,33.83 32.51,34.24 U1.GPIO15
  Bottom 0.203: v35.97,22.66 42.47,22.66 42.88,22.25 43.69,22.25 44.09,22.66 44.09,23.47 43.69,23.88 43.18,23.88 40.95,26.11 40.95,27.43 v34.54,33.83
GPIO16
  Top 0.203: R6.2 12.9,45.11 12.9,43.08 15.65,40.34 16.05,40.34 U1.GPIO16
N$1
  Top 0.203: R32.2 19.41,19.71 19.41,21.03 19.81,21.44 CHG.C
N$2
  Top 0.203: Q3.1 17.58,27.13 17.58,26.31 16.76,25.5 16.76,24.18 17.68,23.27 R37.1
N$5
  Top 0.203: Q6.1 22.35,27.13 21.64,27.13 19.41,24.89 R36.1
N$6
  Top 0.203: U$44.7 24.18,17.07 23.37,17.07 22.45,17.98 Y1.1
N$9  (via drill 0.51)
  Top 0.203: v13.11,48.16 12.6,48.67 11.89,48.67 R25.2 | v36.78,45.92 38,44.7 J6.1
  Bottom 0.203: v13.11,48.16 15.24,48.16 17.48,45.92 v36.78,45.92
N$10
  Top 0.203: U$44.8 24.18,15.75 22.66,15.75 22.45,15.54 Y1.3
N$14
  Top 0.203: D4.- 6.4,52.83 6.4,50.7 R21.1
N$21
  Top 0.203: R34.1 32.92,27.63 30.07,27.63 29.46,28.24 26.42,28.24 26.21,28.04 26.21,25.4 26.52,25.09 26.52,24.28 25.6,23.37 24.28,23.37 U$44.2
N$22
  Top 0.203: D5.- 11.68,50.7 R22.1
N$27  (via drill 0.51)
  Top 0.203: v36.78,21.74 36.78,23.06 36.27,23.57 36.27,24.18 35.36,25.09 33.83,25.09 33.02,25.91 R35.1 | v25.7,22.55 24.69,22.55 24.28,22.15 U$44.3
  Bottom 0.203: v36.78,21.74 36.78,19.71 36.17,19.1 35.15,19.1 30.28,23.98 27.13,23.98 v25.7,22.55
N$30  (via drill 0.51)
  Top 0.203: v31.19,21.84 31.9,22.55 32.92,22.55 R15.1 | v28.14,23.16 28.14,26.21 27.13,27.23 Q7.1
  Bottom 0.203: v31.19,21.84 29.46,21.84 v28.14,23.16
POW
  Top 0.381: D7.C 28.55,7.42 28.55,9.35 D6.C 30.01,9.53 32.29,7.24 | U2.3 34.22,8.19 34.04,8.38 32.51,8.38 32.26,8.13 32.26,7.28 U2.1
  Top 0.406: C6.1 28.52,10.34 D6.C | 32.29,7.24 U2.1
PROG
  Top 0.203: R33.2 13.21,24.89 13.21,22.66 12.39,21.84 U4.5
RST  (via drill 0.51)
  Top 0.203: K2.4 36.98,4.17 40.44,4.17 K2.3 40.44,4.27 v40.44,9.75 | 18.49,43.38 18.49,44.3 16.56,46.23 16.15,46.23 U1.RESET 16.05,46.33 16.05,47.04 13.72,49.38 13.72,50.7 R1.1 | 18.49,43.38 18.49,41.55 | 18.49,41.55 18.49,29.36 Q3.3 | 18.49,43.38 14.63,43.38 14.02,43.99 14.02,45.41 12.9,46.53 12.9,46.74 R6.1 | 18.49,41.55 v19.71,41.55
  Bottom 0.203: v40.44,9.75 40.44,15.04 45.72,20.32 45.72,26.62 30.79,41.55 v19.71,41.55
RTS  (via drill 0.51)
  Top 0.203: Q3.2 19.41,27.13 19.41,26.52 17.78,24.89 R36.2 17.88,24.89 18.69,24.08 20.12,24.08 v20.73,23.47 | v26.92,22.05 29.57,22.05 U$44.14
  Bottom 0.203: v26.92,22.05 26.42,22.05 26.11,21.74 22.45,21.74 v20.73,23.47
RX
  Top 0.203: R34.2 34.65,27.63 36.27,29.26 36.27,29.36 37.59,30.68 J3.1 37.49,30.68 37.49,32.11 35.05,34.54 35.05,42.16 32.92,44.3 32.51,44.3 U1.RXD0
STAT
  Top 0.203: R32.1 17.68,19.71 15.04,19.71 14.63,20.12 12.9,20.12 12.39,19.61 12.39,19.2 U4.1
TX
  Top 0.203: R35.2 34.65,25.91 34.85,25.91 37.59,28.65 38,28.65 J3.2 38.1,28.75 38.41,28.75 39.73,30.07 39.73,31.29 35.66,35.36 35.66,43.59 33.02,46.23 32.51,46.23 U1.TXD0
VBAT  (via drill 0.51)
  Top 0.381: v15.95,17.48 14.33,19.1 U4.3 | v16.15,13.51 17.17,12.5 C3.1 17.37,12.5 18.09,13.21 19.41,13.21 23.06,9.55 24.79,9.55 D6.A
  Top 0.406: C3.1 17.27,7.27 J9.2
  Bottom 0.381: v15.95,17.48 15.95,13.72 v16.15,13.51
VBUS  (via drill 0.51)
  Top 0.381: 15.24,21.54 14.53,21.54 14.33,21.74 U4.4 | 15.24,21.54 17.68,21.54 CHG.A | v15.24,20.73 15.24,21.54 | v26.31,6.91 26.41,7
  Top 0.406: U$35.1 28.53,4.41 28.53,4.88 26.41,7 26.17,7.24 D7.A
  Bottom 0.381: v15.24,20.73 15.24,18.09 11.28,14.12 11.28,3.66 11.79,3.15 22.55,3.15 v26.31,6.91

### Text on the board
tPlace: GND | A0 | 3V3 | NC | 12 | Digital0 | 3V3 | Analog | 14 | GND | GND | 3 | 1 | 3V3 | 13 | 3V3 | UART | Digital1 | 12 | G | GND | 5 | 3V3 | 4 | I2C | 2 | 3V3 | Digital2 | 13 | + | - | GND | BAT | CONFIG | RESET
bPlace: Blocky NODE WiFi
tNames: RX | TX